# EAGLE design electronicload (EAGLE 9.5.2)
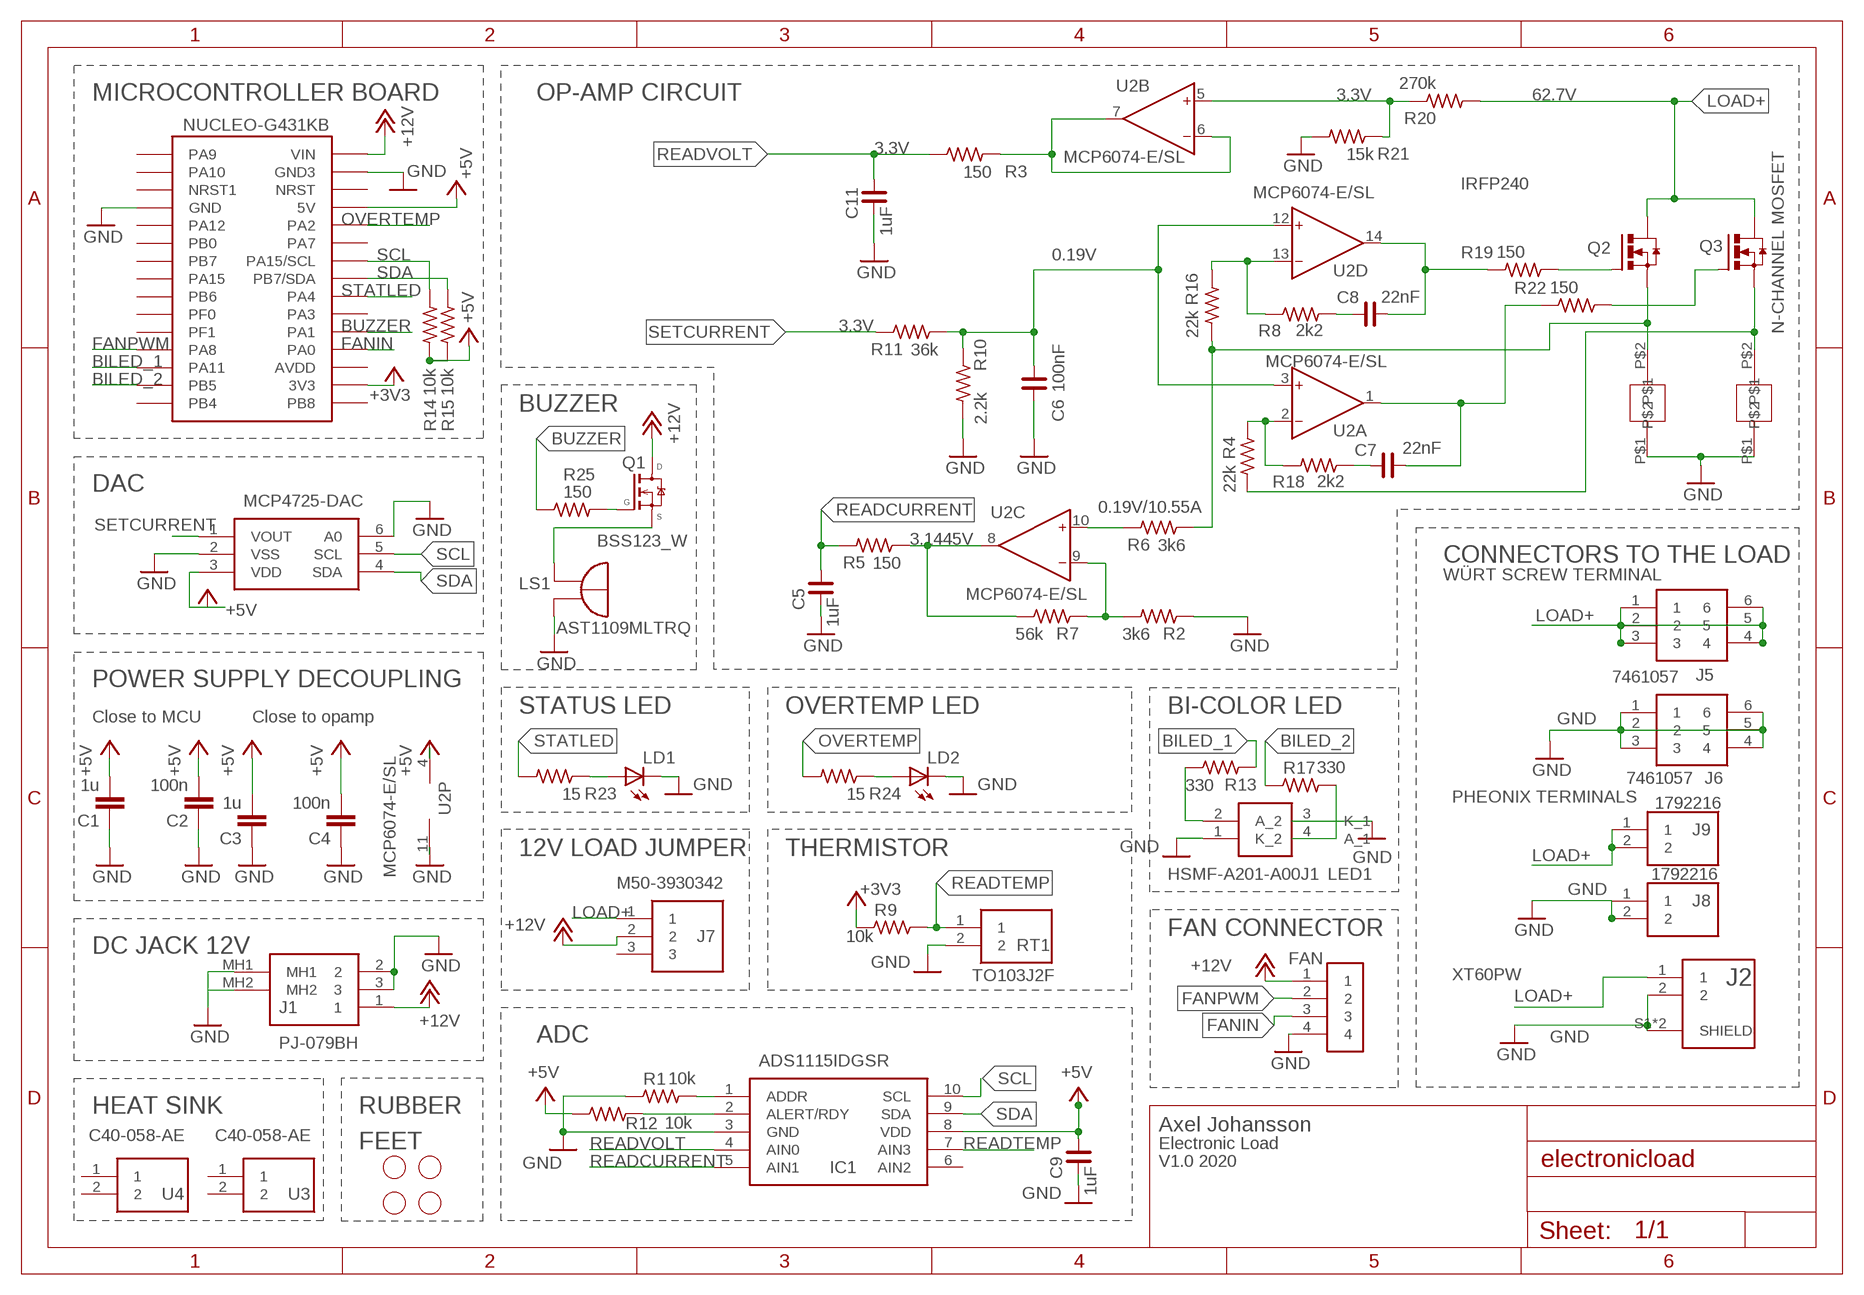
[diagram p0: schematic, sheet 1]

## Parts
C1  1u  C-EUC0603K  [C0603K]
C2  100n  C-EUC0603K  [C0603K]
C3  1u  C-EUC0603K  [C0603K]
C4  100n  C-EUC0603K  [C0603K]
C5  1uF  C_0805  [C0805]
C6  100nF  C_0805  [C0805]
C7  22nF  C_0805  [C0805]
C8  22nF  C_0805  [C0805]
C9  1uF  C_0805  [C0805]
C11  1uF  C_0805  [C0805]
FAN  B4B-PH-K-S(LF)(SN)  [JST_B4B-PH-K-S(LF)(SN)]
IC1  ADS1115IDGSR  [SOP50P490X110-10N]
J1  PJ-079BH  [PJ079BH]
J2  XT60PW-F  [AMASS_XT60PW-F]
J5  7461057  [7461057]
J6  7461057  [7461057]
J7  M50-3930342  [M503930342]
J8  1792216  [1792216]
J9  1792216  [1792216]
LD1  LEDCHIP-LED0805  [CHIP-LED0805]
LD2  LEDCHIP-LED0805  [CHIP-LED0805]
LED1  HSMF-A201-A00J1  [AVAGO_PLCC4]
LS1  AST1109MLTRQ  [XDCR_AST1109MLTRQ]
MCP4725-DAC  MCP4725A0T-E_CH  [SOT95P270X145-6N]
Q1  BSS123_W  [SOT23_GSD_W]
Q2  IRFP240  [TO247AC]
Q3  IRFP240  [TO247AC]
R1  10k  R_0805  [R0805]
R2  3k6  R_0805  [R0805]
R3  150  R_0805  [R0805]
R4  22k  R_0805  [R0805]
R5  150  R_0805  [R0805]
R6  3k6  R_0805  [R0805]
R7  56k  R_0805  [R0805]
R8  2k2  R_0805  [R0805]
R9  10k  R_0805  [R0805]
R10  2.2k  R_0805  [R0805]
R11  36k  R_0805  [R0805]
R12  10k  R_0805  [R0805]
R13  330  R_0805  [R0805]
R14  10k  R_0805  [R0805]
R15  10k  R_0805  [R0805]
R16  22k  R_0805  [R0805]
R17  330  R_0805  [R0805]
R18  2k2  R_0805  [R0805]
R19  150  R_0805  [R0805]
R20  270k  R_0805  [R0805]
R21  15k  R_0805  [R0805]
R22  150  R_0805  [R0805]
R23  15  R_0805  [R0805]
R24  15  R_0805  [R0805]
R25  150  R_0805  [R0805]
RT1  TO103J2F  [TO508P483X1016X2337-2P]
U2  MCP6074-E/SL  AD8608R  [SO14]
U3  C40-058-AE  [C40058AE]
U4  C40-058-AE  [C40058AE]
U$1  NANO  [NANO]
U$2  RUBBER_FEET  [RUBBER_FEET]
U$3  CURRENTSENSE_RESISTOR_SMD2817  [CURRENTSENSE_RESISTOR_SMD2817]
U$4  CURRENTSENSE_RESISTOR_SMD2817  [CURRENTSENSE_RESISTOR_SMD2817]
U$5  RUBBER_FEET  [RUBBER_FEET]
U$6  RUBBER_FEET  [RUBBER_FEET]
U$7  RUBBER_FEET  [RUBBER_FEET]

## Nets
+3V3: R9.1 U$1.RX1(3V3)
+5V: C1.2 C2.2 C3.2 C4.2 C9.2 IC1.8(VDD) MCP4725-DAC.3(VDD) R12.1 R14.1 R15.1 U2.4(P:V+) U$1.D9(5V)
+12V: FAN.1 J1.1 J7.2 Q1.D U$1.D12(VIN)
BILED_1: R13.1 U$1.RST(PA11)
BILED_2: R17.1 U$1.GND(PB5)
BUZZER: R25.1 U$1.D2(PA1)
FANIN: FAN.3 U$1.GND1(PA0)
FANPWM: FAN.2 U$1.5V(PA8)
GND: C1.1 C2.1 C3.1 C4.1 C5.1 C6.1 C9.1 C11.1 FAN.4 IC1.3(GND) J1.2 J1.3 J1.MH1 J1.MH2 J2.2 J2.S1(SHIELD) J2.S2(SHIELD) J6.1 J6.2 J6.3 J6.4 J6.5 J6.6 J8.1 J8.2 LD1.C LD2.C LED1.1(K_2) LED1.3(K_1) LS1.2 MCP4725-DAC.2(VSS) MCP4725-DAC.6(A0) R1.1 R2.1 R10.2 R21.2 RT1.2 U2.11(P:V-) U$1.A0(GND) U$1.D11(GND3) U$3.P$1 U$4.P$1
LOAD+: J2.1 J5.1 J5.2 J5.3 J5.4 J5.5 J5.6 J7.1 J9.1 J9.2 Q2.2(D) Q3.2(D) R20.1
N$1: C8.1 R19.1 U2.14(D:OUT)
N$2: R3.1 U2.6(B:IN-) U2.7(B:OUT)
N$3: R6.2 U2.10(C:IN+)
N$4: R8.1 R16.1 U2.13(D:IN-)
N$5: R20.2 R21.1 U2.5(B:IN+)
N$6: Q2.1(G) R19.2
N$7: R2.2 R7.1 U2.9(C:IN-)
N$8: IC1.1(ADDR) R1.2
N$9: R5.1 R7.2 U2.8(C:OUT)
N$10: IC1.2(ALERT/RDY) R12.2
N$11: LED1.4(A_1) R17.2
N$12: C8.2 R8.2
N$13: LED1.2(A_2) R13.2
N$15: Q2.3(S) R6.1 R16.2 U$4.P$2
N$16: Q3.3(S) R4.2 U$3.P$2
N$17: R4.1 R18.1 U2.2(A:IN-)
N$18: C6.2 R10.1 R11.1 U2.3(A:IN+) U2.12(D:IN+)
N$19: C7.2 R18.2
N$20: Q3.1(G) R22.2
N$21: C7.1 R22.1 U2.1(A:OUT)
N$22: LD1.A R23.1
N$23: LD2.A R24.1
N$24: LS1.1 Q1.S
N$25: Q1.G R25.2
OVERTEMP: R24.2 U$1.D8(PA2)
READCURRENT: C5.2 IC1.5(AIN1) R5.2
READTEMP: IC1.7(AIN3) R9.2 RT1.1
READVOLT: C11.2 IC1.4(AIN0) R3.2
SCL: IC1.10(SCL) MCP4725-DAC.5(SCL) R14.2 U$1.D6(PA15/SCL)
SDA: IC1.9(SDA) MCP4725-DAC.4(SDA) R15.2 U$1.D5(PB7/SDA)
SETCURRENT: MCP4725-DAC.1(VOUT) R11.2
STATLED: R23.2 U$1.D4(PA4)
Unconnected: IC1.6(AIN2) J7.3 U3.1 U3.2 U4.1 U4.2 U$1.3.3V(PA10) U$1.A1(PA12) U$1.A2(PB0) U$1.A3(PB7) U$1.A4(PA15) U$1.A5(PB6) U$1.A6(PF0) U$1.A7(PF1) U$1.AREF(NRST1) U$1.D3(PA3) U$1.D7(PA7) U$1.D10(NRST) U$1.D13(PA9) U$1.RAW(PB4) U$1.RST1(AVDD) U$1.TX0(PB8)

## Notes on the sheet
- MICROCONTROLLER BOARD | OP-AMP CIRCUIT | 3.3V | 62.7V
- 3.3V
- 0.19V
- 3.3V | N-CHANNEL MOSFET
- BUZZER
- DAC
- 0.19V/10.55A
- 3.1445V
- CONNECTORS TO THE LOAD
- WÜRT SCREW TERMINAL
- POWER SUPPLY DECOUPLING
- STATUS LED | OVERTEMP LED | BI-COLOR LED
- Close to MCU | Close to opamp
- PHEONIX TERMINALS
- 12V LOAD JUMPER | THERMISTOR
- FAN CONNECTOR
- DC JACK 12V
- XT60PW
- ADC
- HEAT SINK | RUBBER
- Axel Johansson
- FEET | Electronic Load
- V1.0 2020

## Library data of the parts
C1 C3 = rcl:C-EU: CAPACITOR, European symbol; DIGIKEY: 311-1444-1-ND; TEMPCOEFF: X5R; TOLERANCE: 10%; VOLTAGE: 16V
C2 C4 = rcl:C-EU: CAPACITOR, European symbol; DIGIKEY: 445-7456-1-ND; TEMPCOEFF: X5R; TOLERANCE: 10%; VOLTAGE: 50V
C5-C9 C11 = rc-master-smd:C_: NON-POLARIZED CAP
FAN = B4B-PH-K-S_LF__SN_:B4B-PH-K-S(LF)(SN): PH Series 4 Position 2 mm Pitch Through Hole Crimp Top Entry Shrouded Header Buy Part <https://snapeda.com/parts/B4B-PH-K-S%28LF%29%28SN%29/JST%20Sales/view-part/?ref=eda>; ARROW_ELECTRONICS-PURCHASE-URL: https://snapeda.com/shop?store=Arrow+Electronics&id=422410; AVAILABILITY: Good; DESCRIPTION: Connector Header Through Hole 4 position 0.079 (2.00mm); DIGIKEY-PURCHASE-URL: https://snapeda.com/shop?store=DigiKey&id=422410; MF: JST Sales; MP: B4B-PH-K-S(LF)(SN); PACKAGE: None; PRICE: None
IC1 = ADS1115IDGSR:ADS1115IDGSR: 16-Bit 860SPS 4-Ch Delta-Sigma ADC With PGA, Oscillator, Vref, Comparator, and I2C Source: Datasheet <http://www.ti.com/lit/gpn/ADS1115>; DESCRIPTION: 16-Bit 860SPS 4-Ch Delta-Sigma ADC With PGA, Oscillator, Vref, Comparator, and I2C; HEIGHT: 1.1mm; MANUFACTURER_NAME: Texas Instruments; MANUFACTURER_PART_NUMBER: ADS1115IDGSR; MOUSER_PART_NUMBER: 595-ADS1115IDGSR; MOUSER_PRICE-STOCK: https://www.mouser.co.uk/ProductDetail/Texas-Instruments/ADS1115IDGSR?qs=IK5e5L0zOXjKCJoVMhYO%2FQ%3D%3D
J1 = PJ-079BH:PJ-079BH: DC Power Connectors power jack, 2.5 x 5.8 mm, horizontal, through hole, high current, w/ shielding,1 switch Source: Datasheet; DESCRIPTION: DC Power Connectors power jack, 2.5 x 5.8 mm, horizontal, through hole, high current, w/ shielding,1 switch; HEIGHT: 7.3mm; MANUFACTURER_NAME: CUI Devices; MANUFACTURER_PART_NUMBER: PJ-079BH; MOUSER_PART_NUMBER: 490-PJ-079BH; MOUSER_PRICE-STOCK: https://www.mouser.co.uk/ProductDetail/CUI-Devices/PJ-079BH?qs=l7cgNqFNU1gx%252Bc54Dso%252BFw%3D%3D
J2 = XT60PW-F:XT60PW-F: Socket DC Supply Connector Female; AVAILABILITY: Unavailable; MF: AMASS; MP: XT60PW-F; PACKAGE: Package; PRICE: None
J5 J6 = 7461057:7461057: PCB power element bush terminal, 6P, M3 Source: Datasheet <https://katalog.we-online.com/em/datasheet/7461057.pdf>; DESCRIPTION: PCB power element bush terminal, 6P, M3; HEIGHT: 6.2mm; MANUFACTURER_NAME: Wurth Elektronik; MANUFACTURER_PART_NUMBER: 7461057; MOUSER_PART_NUMBER: 710-7461057; MOUSER_PRICE-STOCK: https://www.mouser.co.uk/ProductDetail/Wurth-Elektronik/7461057?qs=lykWx4dhCCH1DoqS0WFLUA%3D%3D
J7 = M50-3930342:M50-3930342: Headers & Wire Housings 3 WAY SIL HORIZ PCT P/HDR Source: Datasheet <https://cdn.harwin.com/pdfs/M50-393.pdf>; DESCRIPTION: Headers & Wire Housings 3 WAY SIL HORIZ PCT P/HDR; HEIGHT: 2.1mm; MANUFACTURER_NAME: Harwin; MANUFACTURER_PART_NUMBER: M50-3930342; MOUSER_PART_NUMBER: 855-M50-3930342; MOUSER_PRICE-STOCK: https://www.mouser.co.uk/ProductDetail/Harwin/M50-3930342?qs=%252BdQmOuGyFcGtqBmjRfKT5w%3D%3D
J8 J9 = 1792216:1792216: PCB Terminal Block 1792216 Source: Datasheet <https://www.phoenixcontact.com/online/portal/gb?uri=pxc-oc-itemdetail:pid=1792216&library=gben&tab=1>; DESCRIPTION: PCB Terminal Block 1792216; HEIGHT: 34.1mm; MANUFACTURER_NAME: Phoenix Contact; MANUFACTURER_PART_NUMBER: 1792216; MOUSER_PART_NUMBER: 651-1792216; MOUSER_PRICE-STOCK: https://www.mouser.co.uk/ProductDetail/Phoenix-Contact/1792216?qs=q88POAGIlTEjDDsjGtTDSQ%3D%3D
LD1 LD2 = led:LED: LED OSRAM: - CHIPLED LG R971, LG N971, LY N971, LG Q971, LY Q971, LO R971, LY R971 LH N974, LH R974 LS Q976, LO Q976, LY Q976 LO Q996 - Hyper CHIPLED LW Q18S LB Q993, LB Q99A, LB R99A - SideLED LS A670, LO A670, LY A670, LG A670, LP A670 LB A673, LV A673, LT A673, LW A673 LH A674 LY A675 LS A676, LA A676, LO A676, LY A676, LW A676 LS A679, LY A679, LG A679 - Hyper Micro SIDELED® LS Y876, LA Y876, LO Y876, LY Y876 LT Y87S - SmartLED LW L88C, LW L88S LB L89C, LB L89S, LG L890 LS L89K, LO L89K, LY L89K LS L896, LA L896, LO L896, LY L896 - TOPLED LS T670, LO T670, LY T670, LG T670, LP T670 LSG T670, LSP T670, LSY T670, LOP T670, LYG T670 LG T671, LOG T671, LSG T671 LB T673, LV T673, LT T673, LW T673 LH T674 LS T676, LA T676, LO T676, LY T676, LB T676, LH T676, LSB T676, LW T676 LB T67C, LV T67C, LT T67C, LS T67K, LO T67K, LY T67K, LW E67C LS E67B, LA E67B, LO E67B, LY E67B, LB E67C, LV E67C, LT E67C LW T67C LS T679, LY T679, LG T679 LS T770, LO T770, LY T770, LG T770, LP T770 LB T773, LV T773, LT T773, LW T773 LH T774 LS E675, LA E675, LY E675, LS T675 LS T776, LA T776, LO T776, LY T776, LB T776 LHGB T686 LT T68C, LB T68C - Hyper Mini TOPLED® LB M676 - Mini TOPLED Santana® LG M470 LS M47K, LO M47K, LY M47K Source: http://www.osram.convergy.de/
LED1 = HSMF-A201-A00J1:HSMF-A201-A00J1: Broadcom 569 / 626 nm Bi-colour Red, Yellow-Green LED, PLCC 4 SMD package Source: Datasheet <https://docs.broadcom.com/docs/AV02-0501EN>; DESCRIPTION: Broadcom 569 / 626 nm Bi-colour Red, Yellow-Green LED, PLCC 4 SMD package; HEIGHT: mm; MANUFACTURER_NAME: Avago Technologies; MANUFACTURER_PART_NUMBER: HSMF-A201-A00J1; MOUSER_PART_NUMBER: 630-HSMF-A201-A00J1; MOUSER_PRICE-STOCK: https://www.mouser.co.uk/ProductDetail/Broadcom-Avago/HSMF-A201-A00J1?qs=YDL0qNrpDT7xUGI%252B3u9HMA%3D%3D
LS1 = AST1109MLTRQ:AST1109MLTRQ: AUDIO PIEZO TRANSDUCER 1-20V SMD; DESCRIPTION: Buzzers Transducer, Externally Driven Piezo 5V 1mA 4.1kHz 73dB @ 5V, 10cm Surface Mount Solder Pads; DIGI-KEY_PART_NUMBER: 458-1093-1-ND; MF: Mallory Sonalert; MP: AST1109MLTRQ; PACKAGE: Mallory Sonalert
MCP4725-DAC = MCP4725A0T-E_CH:MCP4725A0T-E_CH: D/A Converter 12-Bit EEPROM I2C SOT23-6 Source: Datasheet <http://ww1.microchip.com/downloads/en/DeviceDoc/22039d.pdf>; DESCRIPTION: D/A Converter 12-Bit EEPROM I2C SOT23-6; HEIGHT: 1.45mm; MANUFACTURER_NAME: Microchip; MANUFACTURER_PART_NUMBER: MCP4725A0T-E/CH; MOUSER_PART_NUMBER: 579-MCP4725A0TECH; MOUSER_PRICE-STOCK: https://www.mouser.co.uk/ProductDetail/Microchip-Technology/MCP4725A0T-E-CH?qs=vkMqrgFpRajeQECZ3goc0A%3D%3D
Q1 = AO3404:BSS123: small signal N-channel MOSFET, enhancement mode
Q2 Q3 = IRFP240:IRFP240: MOSFET N-CH 200V 20A TO-247AC; AVAILABILITY: Unavailable; DESCRIPTION: N-Channel 200V 20A (Tc) 150W (Tc) Through Hole TO-247-3; MF: Vishay Siliconix; MP: IRFP240; PACKAGE: TO-247 Vishay; PRICE: None
R1-R25 = rc-master-smd:R_: RESISTOR
RT1 = TO103J2F:TO103J2F: LITTELFUSE - TO103J2F - NTC THERMISTOR, 10K, RADIAL LEADED Source: Datasheet <https://www.littelfuse.com/~/media/electronics/datasheets/thermistor_probes_and_assemblies/littelfuse_thermistor_probes_assemblies_surface_temperature_sensing_to_220_datasheet.pdf.pdf>; ARROW_PART_NUMBER: TO103J2F; ARROW_PRICE-STOCK: https://www.arrow.com/en/products/to103j2f/littelfuse; DESCRIPTION: LITTELFUSE - TO103J2F - NTC THERMISTOR, 10K, RADIAL LEADED; HEIGHT: 4.826mm; MANUFACTURER_NAME: LITTELFUSE; MANUFACTURER_PART_NUMBER: TO103J2F; MOUSER_PART_NUMBER: 803-TO103J2F; MOUSER_PRICE-STOCK: https://www.mouser.com/Search/Refine.aspx?Keyword=803-TO103J2F
U2 = electronicload:AD8608: Precision, Low Noise, CMOS, Rail-to-Rail, Input/Output Operational Amplifiers http://www.analog.com/static/imported-files/data_sheets/AD8605_8606_8608.pdf
U3 U4 = C40-058-AE:C40-058-AE: Heatsink, 58 x 32 x 46.3mm, TO-247, TO-264, Clip Source: Datasheet <https://www.ohmite.com/assets/docs/sink_c40.pdf?r=false>; DESCRIPTION: Heatsink, 58 x 32 x 46.3mm, TO-247, TO-264, Clip; HEIGHT: 32mm; MANUFACTURER_NAME: Ohmite; MANUFACTURER_PART_NUMBER: C40-058-AE; MOUSER_PART_NUMBER: 588-C40-058-AE; MOUSER_PRICE-STOCK: https://www.mouser.co.uk/ProductDetail/Ohmite/C40-058-AE?qs=HuS4Awdo%2FXZh5qKJbBI1Mw%3D%3D
U$1 = Arduino-clone:NANO: Arduino Nano
U$2 U$5-U$7 = RUBBER_FEET:RUBBER_FEET
U$3 U$4 = CURRENTSENSE_RESISTOR_SMD2817:CURRENTSENSE_RESISTOR_SMD2817

## Board
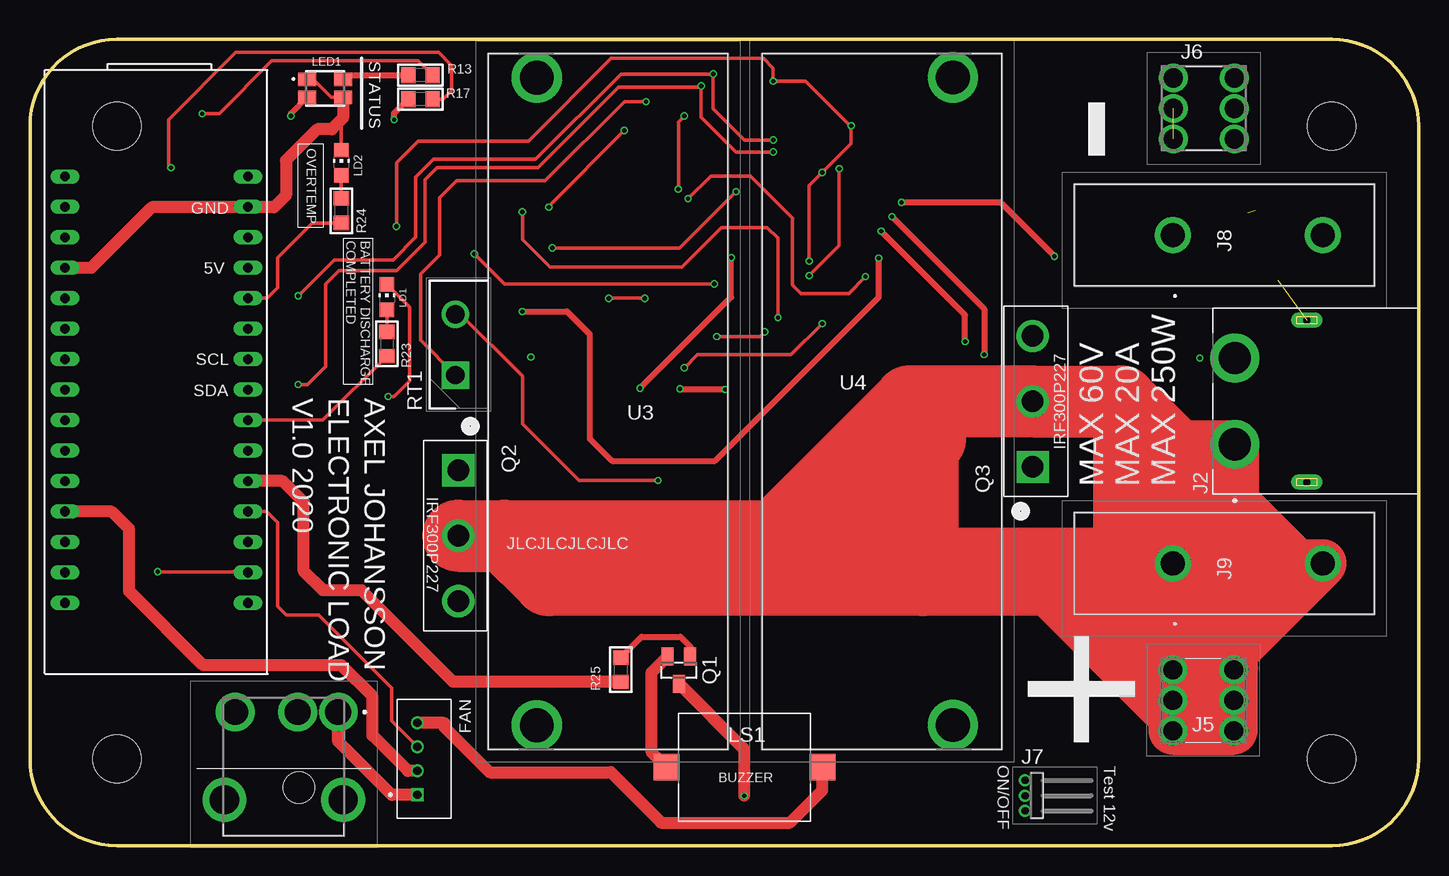
[diagram p1: board, top side]
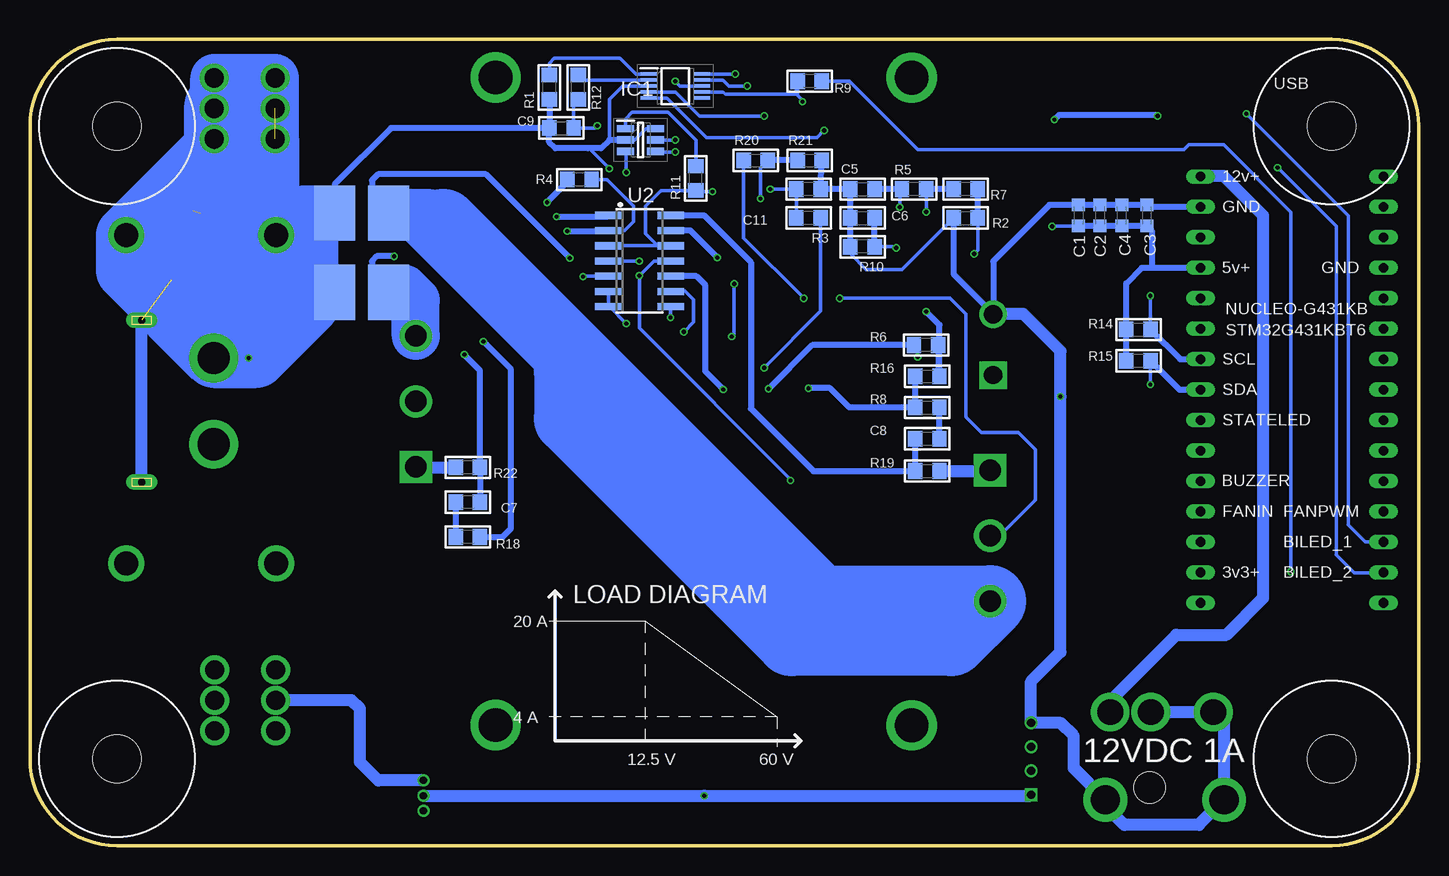
[diagram p2: board, bottom side, seen from below]

Size 115.75 x 67.25 mm. Coordinates in mm from the lower left corner, seen from the top.
Outline: 7.25,67.25 arc90 0,60 0,7.25 arc90 7.25,0 108.5,0 arc90 115.75,7.25 115.75,60 arc90 108.5,67.25 7.25,67.25
Copper layers (1*16): Top 0.018mm / dielectric 1.55mm / Bottom 0.018mm
Design rules "eC_2Layer_PClass6_BaseCopperO18_eCDefault (SODAQ EDIT) *": minimum track width 0.15mm, minimum drill 0.3mm, track to track 0.15mm, track to pad 0.15mm, pad to pad 0.15mm, via to via 0.15mm, smd to smd 0mil, copper to edge 0.25mm, drill to drill 0.3mm, minimum pad ring 0.175mm, minimum via ring 0.125mm, stop-mask expansion 0mil, vias tented up to drill 0.7mm, thermal gap 0.2mm

### Footprints (pad centres in the part's own frame; a part is rotated, then mirrored left to right if it is on the bottom)
C0603K = smd 1.05 x 1.08: 1 -0.875,0; 2 0.875,0
C0805 = smd 1.2 x 1.3: 1 -1.016,0; 2 1.016,0
JST_B4B-PH-K-S(LF)(SN) = drill 0.7 square: 1 3,-0.55 | drill 0.7: 2 1,-0.55; 3 -1,-0.55; 4 -3,-0.55
SOP50P490X110-10N = smd 1.4 x 0.3: 1 -2.2,1; 2 -2.2,0.5; 3 -2.2,0; 4 -2.2,-0.5; 5 -2.2,-1; 6 2.2,-1; 7 2.2,-0.5; 8 2.2,0; 9 2.2,0.5; 10 2.2,1
PJ079BH = drill 2.154 pad 3.2: 1 0,0; 2 0,8.6; 3 0,3.4 | drill 2.435 pad 3.653: MH1 -7.3,9.5; MH2 -7.3,-0.4 | hole 2.6: -6.3,3.3
AMASS_XT60PW-F = drill 2.7: 1 -3.6,0; 2 3.6,0 | drill 0.6 pad 1.3 long: S1 -6.75,-6; S2 6.75,-6
7461057 = drill 1.6 pad 2.3: 1 0,0; 2 0,-2.54; 3 0,-5.08; 4 5.08,-5.08; 5 5.08,-2.54; 6 5.08,0
M503930342 = drill 0.6 pad 1: 1 0,0; 2 1.27,0; 3 2.54,0
1792216 = drill 2 pad 3: 1 0,0; 2 0,-12.5
CHIP-LED0805 = smd 1.2 x 1.2: A 0,-1.05; C 0,1.05
AVAGO_PLCC4 = smd 1.1 x 1.5: 1 -0.75,-1.5; 2 -0.75,1.5; 3 0.75,1.5; 4 0.75,-1.5
XDCR_AST1109MLTRQ = smd 2.2 x 2.2: 1 -6.5,0; 2 6.5,0
SOT95P270X145-6N = smd 1.4 x 0.6: 1 -1.25,0.95; 2 -1.25,0; 3 -1.25,-0.95; 4 1.25,-0.95; 5 1.25,0; 6 1.25,0.95
SOT23_GSD_W = smd 1 x 1.5: D 0,1.15; G -0.95,-1.15; S 0.95,-1.15
TO247AC = drill 1.79 pad 2.69 square: 1 -5.46,0.255 | drill 1.79 pad 2.69: 2 0,0.255; 3 5.46,0.255
R0805 = smd 1.2 x 1.3: 1 -1.016,0; 2 1.016,0
TO508P483X1016X2337-2P = drill 1.53 pad 2.295 square: 1 0,0 | drill 1.53 pad 2.295: 2 5.08,0
SO14 = smd 0.6 x 2.2: 1 -3.81,-2.6; 2 -2.54,-2.6; 3 -1.27,-2.6; 4 0,-2.6; 5 1.27,-2.6; 6 2.54,-2.6; 7 3.81,-2.6; 8 3.81,2.6; 9 2.54,2.6; 10 1.27,2.6; 11 0,2.6; 12 -1.27,2.6; 13 -2.54,2.6; 14 -3.81,2.6
C40058AE = drill 2.8 pad 4.2: 1 5.94,27; 2 5.94,-27
NANO = drill 0.8 long: 3.3V 0.018,33.081; 5V 0.018,7.681; A0 0.018,28.001; A1 0.018,25.461; A2 0.018,22.921; A3 0.018,20.381; A4 0.018,17.841; A5 0.018,15.301; A6 0.018,12.761; A7 0.018,10.221; AREF 0.018,30.541; D2 15.258,10.221; D3 15.258,12.761; D4 15.258,15.301; D5 15.258,17.841; D6 15.258,20.381; D7 15.258,22.921; D8 15.258,25.461; D9 15.258,28.001; D10 15.258,30.541; D11 15.258,33.081; D12 15.258,35.621; D13 0.018,35.621; GND 0.018,2.601; GND1 15.258,7.681; RAW 0.018,0.061; RST 0.018,5.141; RST1 15.258,5.141; RX1 15.258,2.601; TX0 15.258,0.061
RUBBER_FEET = hole 4: 0,0
CURRENTSENSE_RESISTOR_SMD2817 = smd 3.4 x 4.6: P$1 -2.3,0; P$2 2.2,0

### Placement (x,y rotation side)
C1  28.35,52.55 270 bottom
C2  26.55,52.55 270 bottom
C3  22.65,52.55 270 bottom
C4  24.73,52.55 270 bottom
C5  46.35,54.75 0 bottom
C6  46.35,52.35 0 bottom
C7  79.25,28.65 180 bottom
C8  40.95,33.95 0 bottom
C9  71.45,59.85 0 bottom
C11  50.85,54.75 180 bottom
FAN  32.85,7.25 270 top
IC1  61.95,63.35 0 bottom
J1  25.7,11.14 90 top
J2  100.44,37.07 90 top
J5  95.26,14.68 0 top
J6  95.31,64.02 0 top
J7  82.95,5.45 270 top
J8  95.25,50.9 90 top
J9  95.25,23.55 90 top
LD1  29.75,45.75 0 top
LD2  25.95,56.95 0 top
LED1  24.6,63.15 270 top
LS1  59.56,6.55 0 top
MCP4725-DAC  64.85,58.85 0 bottom
Q1  54.09,14.64 180 top
Q2  35.45,25.85 270 top
Q3  83.85,37.05 90 top
R1  72.45,63.25 90 bottom
R2  37.75,52.35 0 bottom
R3  50.85,52.35 180 bottom
R4  69.95,55.55 180 bottom
R5  42.05,54.75 180 bottom
R6  41.05,41.75 180 bottom
R7  37.75,54.75 180 bottom
R8  40.95,36.55 0 bottom
R9  50.75,63.75 180 bottom
R10  46.35,49.95 180 bottom
R11  60.25,55.65 90 bottom
R12  70.05,63.25 90 bottom
R13  32.55,64.25 180 top
R14  23.35,43.05 0 bottom
R15  23.35,40.45 0 bottom
R16  40.95,39.15 0 bottom
R17  32.55,62.25 180 top
R18  79.25,25.75 180 bottom
R19  40.95,31.25 0 bottom
R20  55.25,57.15 0 bottom
R21  50.75,57.15 0 bottom
R22  79.25,31.55 180 bottom
R23  29.75,41.85 270 top
R24  25.95,52.95 270 top
R25  49.26,14.69 90 top
RT1  35.45,39.25 90 top
U2  64.94,48.76 270 bottom
U3  48.2,37.04 180 top
U4  71,37.05 0 top
U$1  2.89,20.19 0 top
U$2  7.25,60 0 top
U$3  88.05,46.15 0 bottom
U$4  88.05,52.75 0 bottom
U$5  7.25,7.25 0 top
U$6  108.5,7.25 0 top
U$7  108.5,60 0 top

### Tracks (layer width: path | path; a pad name or v marks a point on that pad's centre or on a via)
+3V3  (via drill 0.35)
  Top 0.3: v10.65,22.85 18.1,22.85 U$1.RX1
  Bottom 0.3: R9.1 47.45,63.75 41.75,58.05 32.25,58.05 32.05,58.05 19.55,58.05 19.15,58.45 16.25,58.45 10.65,52.85 v10.65,22.85
+5V  (via drill 0.35)
  Top 0.3: v68.45,60.05 68.45,59.95 | 68.45,59.95 68.45,58.55 v66.05,56.15 64.95,55.05 v64.95,48.75 | 68.45,59.95 64.65,63.75 v61.95,63.75 61.95,64.85 61.15,65.65 48.45,65.65 41.55,58.75 32.35,58.75 30.55,56.95 v30.55,51.65
  Bottom 0.3: R12.1 70.43,61.85 C9.2 68.65,59.85 v68.45,60.05 | v66.05,56.15 66.05,57.85 MCP4725-DAC.3 | U2.4 64.96,48.76 v64.95,48.75 | IC1.8 61.55,63.35 v61.95,63.75 | v30.55,51.65 28.38,51.65 C1.2
  Bottom 0.5: 22.25,48.2 23.07,48.2 24.37,46.9 R14.1 R15.1 | 22.25,48.2 22.25,51.27 C3.2 C4.2 C2.2 C1.2 | 22.25,48.2 U$1.D9
  Bottom 0.508: C4.2 24.75,51.66
+12V  (via drill 0.35)
  Top 1: FAN.1 30.15,4.25 25.7,8.7 J1.1 | Q1.D 59.54,8.04 v59.54,4.18
  Bottom 1: J1.1 25.7,12.1 20.2,17.6 16,17.6 12.95,20.65 12.95,52.55 16.25,55.85 18.12,55.85 U$1.D12 | J7.2 v59.54,4.18 32.37,4.18 FAN.1
BILED_1  (via drill 0.35)
  Top 0.3: R13.1 32.37,65.45 20.15,65.45 15.75,61.05 v14.35,61.05
  Bottom 0.3: v14.35,61.05 5.85,52.55 5.85,26.75 4.43,25.34 U$1.RST
BILED_2  (via drill 0.35)
  Top 0.3: R17.1 34.45,62.25 35.15,62.95 35.15,65.05 34.05,66.15 17.15,66.15 11.55,60.55 11.55,56.75 v11.75,56.55
  Bottom 0.3: v11.75,56.55 6.85,51.65 6.85,24.25 5.35,22.75 2.96,22.75 U$1.GND
BUZZER
  Top 1: U$1.D2 21.07,30.41 22.83,28.65 22.83,22.89 24.42,21.3 27.64,21.3 35.27,13.67 R25.1
FANIN
  Top 0.3: FAN.3 30.15,10.4 30.15,13.15 24.05,19.25 21.35,19.25 20.65,19.95 20.65,26.95 19.73,27.88 U$1.GND1
FANPWM
  Top 1: FAN.2 31.5,6.25 28.55,9.2 28.55,12.45 25.95,15.05 14.45,15.05 8.25,21.25 8.25,26.44 6.81,27.88 U$1.5V
GND  (via drill 0.35)  (3 unrouted)
  Top 0.3: v64.95,47.55 67.45,50.05 v67.45,56.45 | v52.35,30.45 45.75,30.45 41.05,35.15 41.05,39.15 35.87,44.33 RT1.2 | LED1.3 25.1,62.4 23.6,63.9 LED1.1 | LD1.C 31.65,44.9 31.65,38.75 30.35,37.45 v29.85,37.45 | LD2.C 25.95,61.6 26.1,61.75
  Top 1: U$1.A0 5.09,48.2 10.15,53.25 18.13,53.25 | 18.13,53.25 U$1.D11 18.68,53.27 | LED1.3 26.1,61.75 26.1,60.7 25.15,59.75 23.95,59.75 21.35,57.15 21.35,54.25 20.35,53.25 18.13,53.25 | FAN.4 34.5,10.25 34.53,10.22 34.53,9.91 38.31,6.13 48.43,6.13 52.6,1.96 52.6,1.93 63.35,1.93 66.06,4.64 LS1.2
  Bottom 0.3: 72.17,62.23 R1.1 | MCP4725-DAC.6 64.4,59.8 65.35,58.85 MCP4725-DAC.2 | U2.11 63.74,48.76 v64.95,47.55 64.95,43.15 52.35,30.55 v52.35,30.45 | v67.45,56.45 69.15,58.15 69.25,58.15 | R2.1 43.07,48.05 46.05,48.05 47.37,49.37 R10.2 | IC1.3 66.35,63.35 67.45,62.25 67.45,58.85
  Bottom 0.5: U$4.P$1 90.35,55.15 85.65,59.85 C9.1 | R10.2 C6.1 C5.1 C11.1 R21.2 | U$1.D11 22.5,53.27 C3.1 C4.1 C2.1 C1.1 30.77,53.42 35.45,48.75 RT1.2 | MCP4725-DAC.2 67.45,58.85 68.15,58.15 69.25,58.15 71.95,58.15 72.47,58.67 C9.1 | R1.1 72.45,59.87 C9.1 | R2.1 38.77,47.69 35.43,44.35
  Bottom 1: J1.3 J1.2 16.2,10.24 J1.MH1 18.3,1.75 24.51,1.75 26.41,3.65 26.21,3.84 J1.MH2 28.75,6.49 28.75,9.15 29.85,10.25 FAN.4 32.3,13.7 29.85,16.15 v29.85,37.45 29.85,41.25 32.95,44.35 35.43,44.35 RT1.2 | J2.S1 J2.S2 | J2.S2 103.28,40.67 J2.2 | J2.S2 105.86,43.25 104.75,43.25 104.75,44.75 105.75,44.75 107.75,46.75 107.75,49.74 | J2.S2 106.44,44.44 107.75,45.75 J8.2
  Bottom 3: v97.52,40.67 95.83,40.67 U$3.P$1 | U$3.P$1 90.35,46.75 95.31,51.71 J6.3 | U$3.P$1 92.23,46.15 95.38,49.3 95.38,50.9 J8.1 94,50.9 92.95,51.95 92.95,53.55 92.05,53.55 91.25,52.75 U$4.P$1
  Bottom 4: J6.5 J6.2 | J6.3 J6.1 J6.6 100.39,61.75 J6.4 J6.3 | J8.2 95.38,50.9 | J8.2 v97.52,40.67 | v97.52,40.67 95.25,42.94 J8.1 96.1,50.9 97.75,49.25 97.75,43.35 J2.2 | 104,47.15 99,47.15 | J6.3 101.51,52.75 | 102.15,52.95 97.3,52.95 | J6.3 95.31,50.96 | J2.2 v97.52,40.67 | J2.2 102.98,43.22 102.98,44.98 107.75,49.74 J8.2
  Bottom 5: 100.39,61.75 v100.39,58.26 J8.2 107.75,47.98 J2.2 96.89,40.67 92.52,45.05 92.52,51.52 92.95,51.95
LOAD+  (via drill 0.35)
  Top 0.3: v51.25,45.65 v48.25,45.65
  Top 4: J9.1 J9.2 | J9.1 J5.1 | J5.1 J5.2 | J5.2 J5.3 J5.4 J5.5 | J5.5 J5.6 | J5.6 J5.1 | J5.2 J5.5 | J5.6 100.34,16.14 J9.2 | J9.1 98.05,20.75 98.05,17.25 100.34,14.96 J5.6 | J5.6 100.34,21.24 101.25,22.15 | 96.72,32.75 95.25,31.28 J9.1 | 95.25,32.75 96.72,32.75 | 98.22,31.25 J2.1 | 98.22,31.25 99.98,29.48 99.98,29.16 105.59,23.55 J9.2 | 98.22,31.25 96.72,32.75 | J9.1 98.45,26.75 99.25,26.75 | J2.1 100.44,28.73 J9.1 | J2.1 95.53,33.47 91.25,37.75
  Top 6: 95.25,32.75 90.95,37.05 Q3.2 73.35,37.05 62.15,25.85 | 62.15,25.85 Q2.2 39.55,25.85 43.25,22.15 | 62.15,25.85 62.45,25.55 | 71.15,23.55 64.45,23.55 62.45,25.55 | 71.15,23.55 J9.1 95.25,26.75 97.55,29.05 | J5.2 85.25,22.15 74.45,22.15 | 74.45,22.15 43.25,22.15 | 43.25,22.15 43.25,25.55 62.45,25.55 | 74.45,22.15 74.45,33.35 75.05,33.95 75,34 67.85,26.85 71.15,23.55 | J5.1 91.65,18.29 91.65,34.88 95.25,31.28
  Bottom 0.3: Q2.2 34.95,25.85 31.95,28.85 31.95,33.05 33.35,34.45 36.45,34.45 37.75,35.75 37.75,44.35 39.05,45.65 v48.25,45.65 | v51.25,45.65 56.27,50.67 R20.1
  Bottom 1: J5.2 88.96,12.14 88.25,11.42 88.25,6.98 86.72,5.45 J7.1
N$1
  Bottom 0.5: U2.14 59.57,52.57 55.65,48.65 55.65,36.45 50.45,31.25 R19.1 C8.1
N$2  (via drill 0.35)
  Top 0.3: v54.55,39.85 55.65,40.95 63.45,40.95 v66.05,43.55
  Bottom 0.3: U2.6 U2.7 67.45,44.95 v66.05,43.55 | R3.1 49.83,44.57 v54.55,39.85
N$3  (via drill 0.35)
  Top 0.5: v54.2,38.1 57.9,38.1 v57.95,38.05
  Bottom 0.5: R6.2 50.55,41.75 v54.2,38.1 | v57.95,38.05 59.45,39.55 59.45,46.75 60.19,47.49 U2.10
N$4  (via drill 0.35)
  Top 0.5: v50.85,38.15 58.45,45.75 v58.45,49.05
  Bottom 0.5: R16.1 R8.1 47.45,36.55 49.05,38.15 v50.85,38.15 | v58.45,49.05 60.7,51.3 U2.13
N$5  (via drill 0.35)
  Top 0.3: v69.65,47.45 68.25,46.05 64.25,46.05 63.55,46.75 63.55,52.35 60.05,55.85 56.75,55.85 v54.85,53.95
  Bottom 0.3: U2.5 69.61,47.49 v69.65,47.45 | v54.85,53.95 54.85,56.53 R20.2
  Bottom 0.5: R21.1 R20.2
N$6
  Bottom 1: R19.2 35.77,31.25 Q2.1
N$7  (via drill 0.35)
  Top 0.3: v37.05,49.35 39.55,46.85 v57.05,46.85 | v57.25,42.45 60.85,42.45 v61.25,42.85
  Bottom 0.3: R2.2 36.73,49.67 v37.05,49.35 | v57.05,46.85 57.05,42.65 v57.25,42.45 | v61.25,42.85 60.45,43.65 60.45,45.55 61.15,46.25 62.31,46.25 U2.9
  Bottom 0.5: R2.2 R7.1
N$8
  Bottom 0.3: IC1.1 65.25,64.35 66.55,65.65 72.05,65.65 72.45,65.25 R1.2
N$9  (via drill 0.35)
  Top 0.3: v41.05,52.85 41.05,50.55 43.35,48.25 54.35,48.25 57.65,51.55 61.45,51.55 62.35,50.65 v62.35,44.05
  Bottom 0.3: R5.1 41.03,52.87 v41.05,52.85 | v62.35,44.05 62.34,44.06 U2.8
  Bottom 0.5: R7.2 R5.1
N$10
  Bottom 0.3: R12.2 69.63,63.85 IC1.2
N$11  (via drill 0.35)
  Top 0.5: LED1.4 21.75,61.05 v21.75,60.85 | v30.35,60.55 30.35,61.07 R17.2
  Bottom 0.5: v21.75,60.85 21.85,60.95 29.95,60.95 v30.35,60.55
N$12
  Bottom 0.5: C8.2 R8.2
N$13
  Top 0.5: LED1.2 26.45,64.25 R13.2
N$14  (via drill 0.35)
  other vias: 41.75,40.75
N$15  (via drill 0.35)
  Top 0.5: v41.05,44.55 44.75,44.55 46.65,42.65 46.65,33.95 48.5,32.1 57.1,32.1 70.75,45.75 v70.75,49
  Bottom 0.5: R6.1 40.03,39.25 R16.2 39.93,43.43 v41.05,44.55 | 69.22,41.23 70.73,42.73 72.3,42.73 | v70.75,49 77.75,56 86.75,56 87.25,55.5 87.25,54.15 U$4.P$2
  Bottom 3: U$4.P$2 84.25,52.75
  Bottom 4: 83.95,52.75 82.35,52.75 81.35,51.75 | 83.95,52.75 84.25,52.75 | 83.95,52.75 70.75,39.55
  Bottom 6: 81.35,51.75 81.35,51.78 72.3,42.73 49.95,20.39 Q2.3 38.95,17.15 52.25,17.15 70.75,35.65 70.75,39.55
N$16  (via drill 0.35)
  Top 0.5: v85.4,49.15 80.9,53.65 v72.65,53.65
  Bottom 0.5: U$3.P$2 85.25,46.15 | 85.25,46.15 82.55,46.15 | v72.65,53.65 70.97,55.33 R4.2 | v85.4,49.15 86.85,49.15 87.25,48.75 87.25,48.15 85.25,46.15
  Bottom 3: Q3.3 83.15,42.95 83.15,45.35 85.05,45.35 U$3.P$2
  Bottom 4: Q3.3 83.59,45.49 84.55,46.45
N$17  (via drill 0.35)
  Top 0.5: v77.95,42.05 77.95,44.25 v70.95,51.25
  Bottom 0.3: R4.1 67.65,55.55 65.45,53.35 65.45,52.05 66.2,51.3 U2.2
  Bottom 0.5: R18.1 76.35,25.75 75.65,26.45 75.65,39.75 v77.95,42.05 | v70.95,51.25 67.59,51.25 U2.2
N$18  (via drill 0.35)
  Top 0.3: v43.55,49.85 54.15,49.85 v58.85,54.55
  Bottom 0.3: U2.3 U2.12 63.43,50.03 64.45,51.05 64.45,53.35 63.17,54.63 R11.1 60.17,54.55 v58.85,54.55 | R10.1 43.65,49.95 v43.55,49.85
  Bottom 0.5: R10.1 C6.2
N$19
  Bottom 0.5: C7.2 R18.2
N$20
  Bottom 1: Q3.1 83.56,31.55 R22.2
N$21  (via drill 0.35)
  Top 0.5: v79.55,40.95 79.55,44.75 v71.85,52.45
  Bottom 0.5: v79.55,40.95 78.23,39.63 R22.1 C7.1 | v71.85,52.45 67.66,52.45 U2.1
N$22
  Top 0.3: LD1.A R23.1
N$23
  Top 0.3: LD2.A R24.1
N$24
  Top 1: LS1.1 51.83,7.78 51.83,14.48 Q1.S
N$25
  Top 0.3: 49.19,15.78 R25.2
  Top 0.5: R25.2 50.99,17.44 54.21,17.44 55.08,16.57 55.08,15.83 Q1.G
OVERTEMP
  Top 0.3: U$1.D8 19.76,45.66 20.65,46.55 20.65,49.05 23.53,51.93 R24.2
READCURRENT  (via drill 0.35)
  Top 0.3: v49.55,59.65 43.25,53.35 v43.25,53.25
  Bottom 0.3: IC1.5 62.65,62.35 59.35,59.05 50.15,59.05 v49.55,59.65 | v43.25,53.25 43.25,54.57 R5.2
  Bottom 0.5: R5.2 C5.2
READTEMP  (via drill 0.35)
  Top 0.3: v51.35,62.05 49.55,62.05 42.95,55.45 35.55,55.45 34.15,54.05 34.15,49.25 32.55,47.65 32.55,42.15 RT1.1
  Bottom 0.3: IC1.7 57.98,62.85 57.78,62.65 51.77,62.65 R9.2 51.87,63.65 51.87,62.67 51.35,62.15 v51.35,62.05
READVOLT  (via drill 0.35)
  Top 0.3: v54.05,54.75 54.05,60.35 v54.55,60.85
  Bottom 0.3: IC1.4 61.95,62.85 59.95,60.85 v54.55,60.85 | R3.2 C11.2 v54.05,54.75
SCL  (via drill 0.35)
  Top 0.3: v61.95,58.85 59.55,58.85 56.95,61.45 v56.95,64.35 49.25,64.35 42.15,57.25 33.65,57.25 32.15,55.75 32.15,50.75 30.25,48.85 25.35,48.85 v22.35,45.85
  Bottom 0.3: IC1.10 v56.95,64.35 | v61.95,58.85 MCP4725-DAC.5 | R14.2 22.33,45.83 v22.35,45.85
  Bottom 0.5: R14.2 19.86,40.58 U$1.D6
SDA  (via drill 0.35)
  Top 0.3: v61.95,57.85 58.85,57.85 55.95,60.75 v55.95,63.35 55.85,63.25 49.05,63.25 42.35,56.55 33.95,56.55 32.95,55.55 32.95,50.35 30.55,47.95 25.75,47.95 24.65,46.85 24.65,39.95 23.15,38.45 v22.35,38.45
  Bottom 0.3: IC1.9 57.98,63.85 57.48,63.35 v55.95,63.35 | v61.95,57.85 63.55,57.85 MCP4725-DAC.4 | v22.35,38.45 22.33,38.47 R15.2
  Bottom 0.5: R15.2 19.92,38.03 U$1.D5
SETCURRENT
  Bottom 0.3: MCP4725-DAC.1 66.1,60.6 65.55,61.15 62.55,61.15 60.25,58.85 R11.2
STATLED
  Top 0.3: R23.2 24.41,35.49 U$1.D4

### Text on the board
tPlace: MAX 60V / MAX 20A / MAX 250W
tNames: STATUS | OVERTEMP | - | BATTERY DISCHARGE / COMPLETED | V1.0 2020 | ELECTRONIC LOAD | AXEL JOHANSSON | IRF300P227 | IRF300P227 | JLCJLCJLCJLC | + | ON/OFF | Test 12v | BUZZER
bNames: USB | 12v+ | GND | GND | 5v+ | NUCLEO-G431KB | STM32G431KBT6 | SCL | SDA | STATELED | BUZZER | FANPWM | FANIN | BILED_1 | BILED_2 | 3v3+ | LOAD DIAGRAM | 20 A | 4 A | 12VDC 1A | 60 V | 12.5 V